# Altium project FPW1-0-0.PrjPCB (part 2 of 2)
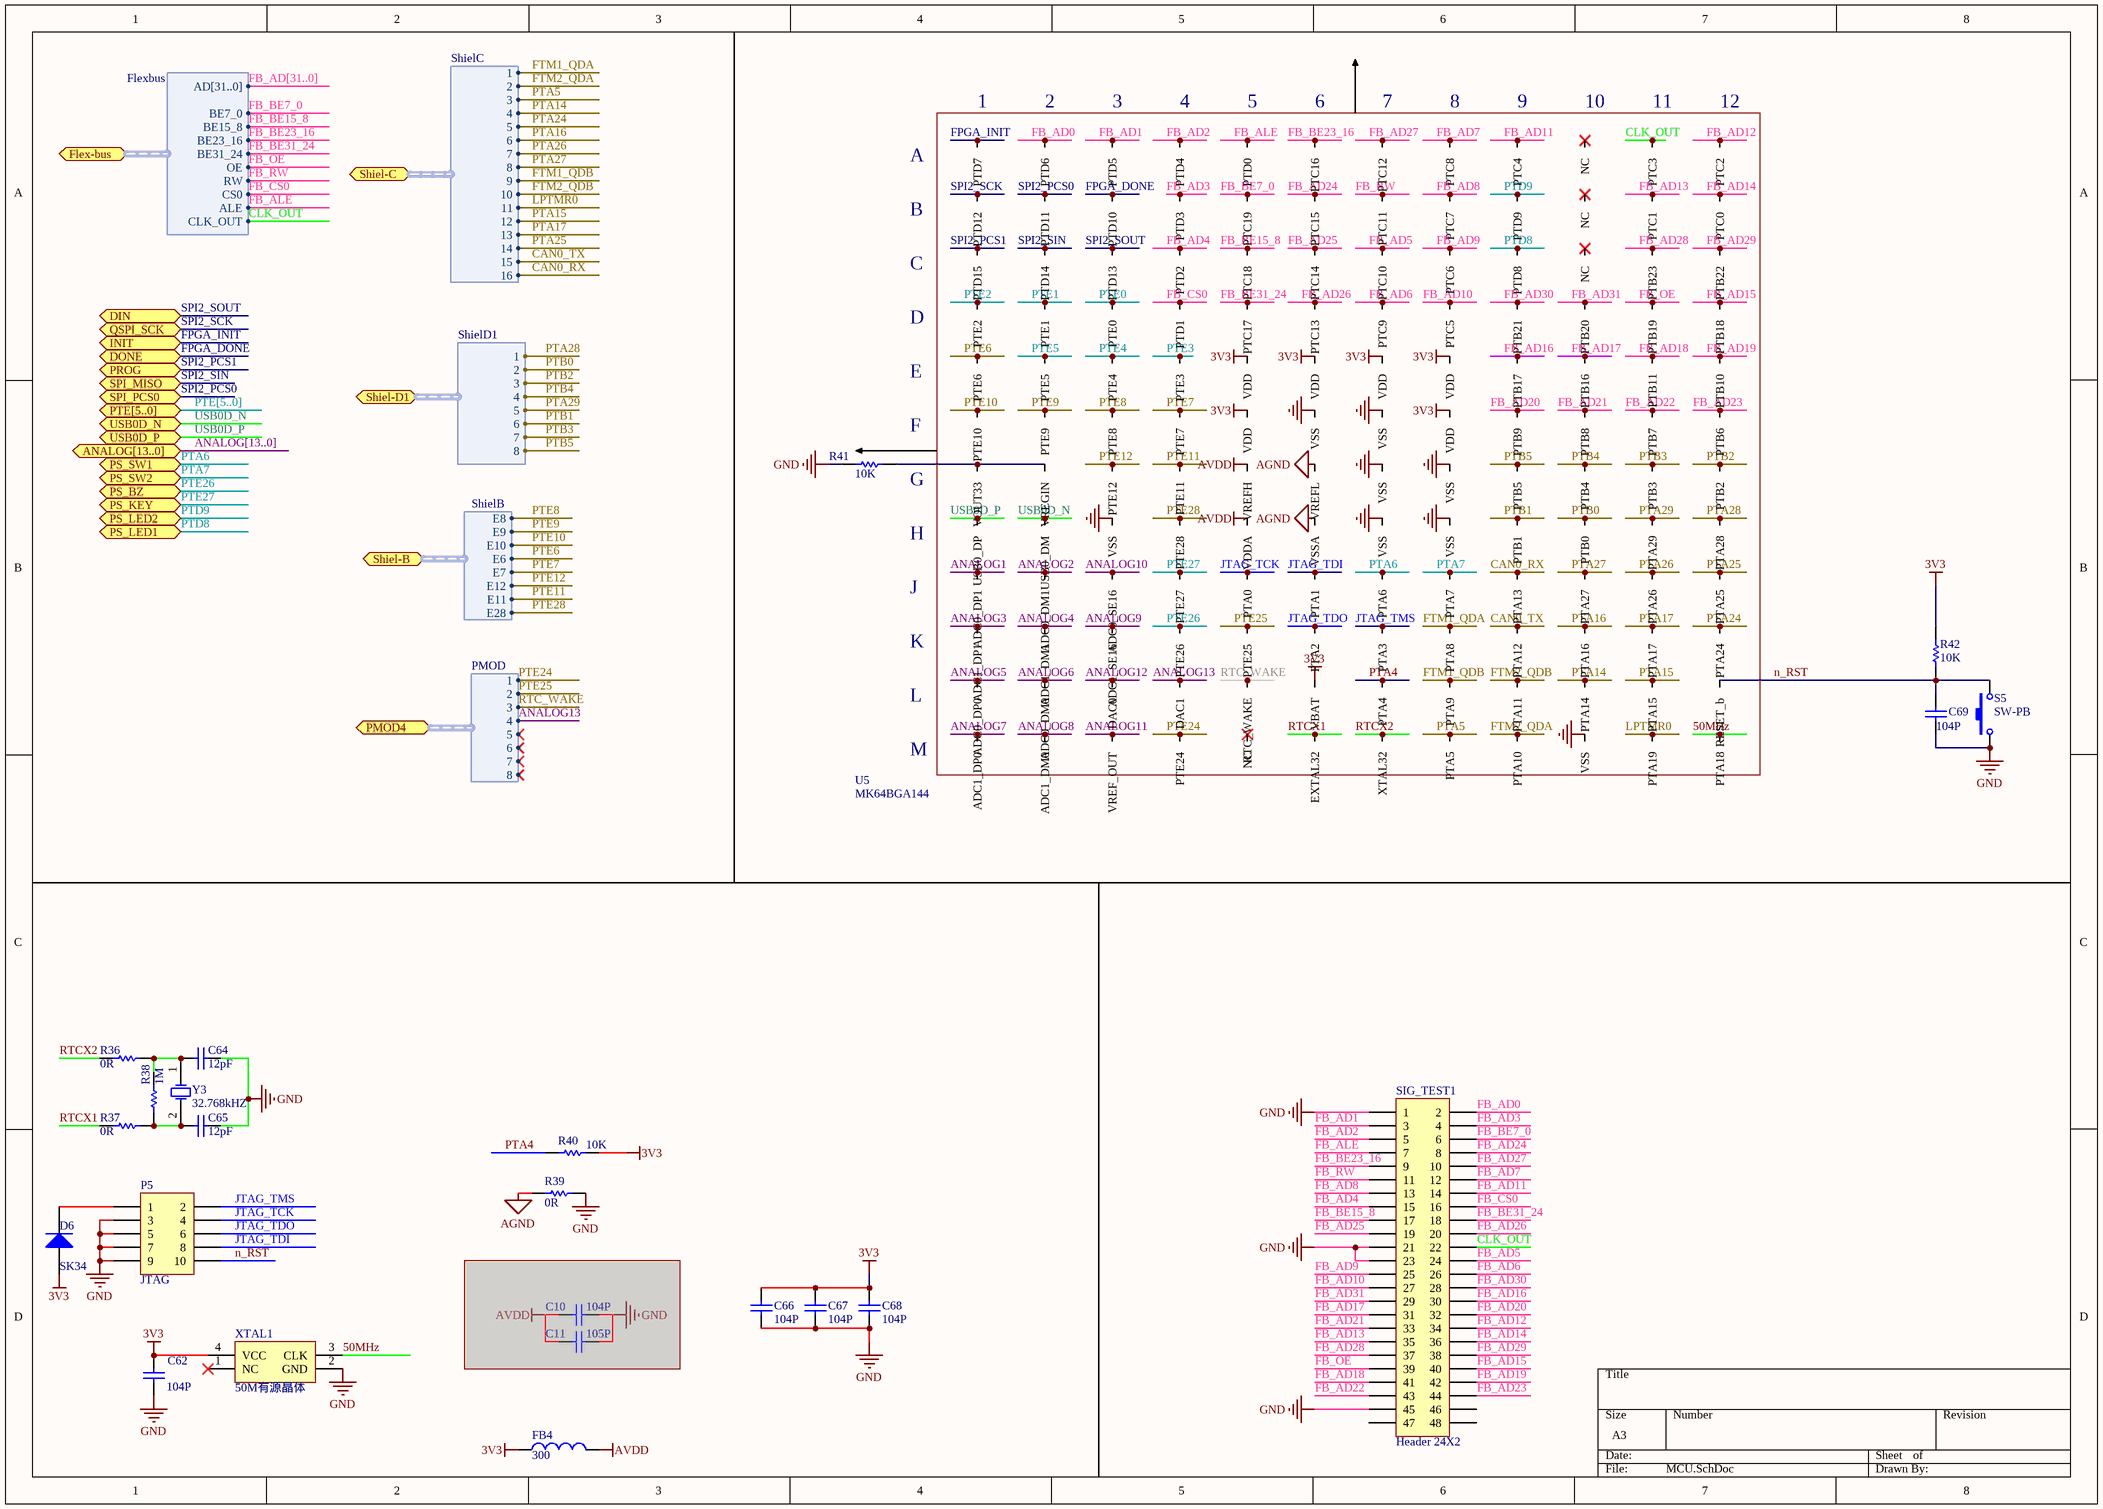
[diagram p8: MCU.SchDoc]

## Nets that join several sheets
1V0: POWER (F2.1), FPGA_POWER (21 pins)
1V8: POWER (F4.1), FPGA_POWER (12 pins)
3V3: FPGA_IO (9 pins), POWER (F3.1), GENERAL-IO (21 pins), MEMORY (8 pins), FPGA_CONFIG (10 pins), FPGA_POWER (55 pins), MCU (16 pins)
5V0: POWER (15 pins), GENERAL-IO (F1.1)
GND: FPGA_IO (6 pins), POWER (11 pins), GENERAL-IO (32 pins), MEMORY (6 pins), FPGA_CONFIG (16 pins), FPGA_POWER (83 pins), MCU (27 pins)
XADCGND: FPGA_CONFIG (U1.H7 U1.H8 U1.J7 U1.J8), FPGA_POWER (C14.2 FB2.2 U1.G7)
ANALOG13: GENERAL-IO (PMOD4.3), MCU (U5.L4)
BANK14_IO1: FPGA_IO (U1.K12), GENERAL-IO (S2.1)
BANK14_IO2: FPGA_IO (U1.L14), GENERAL-IO (LED1.3)
BANK14_IO3: FPGA_IO (U1.M14), GENERAL-IO (HAT1.5)
BANK14_IO4: FPGA_IO (U1.K13), GENERAL-IO (LED1.1)
BANK14_IO5: FPGA_IO (U1.L13), GENERAL-IO (LED1.4)
BANK14_IO6: FPGA_IO (U1.M12), GENERAL-IO (R24.2)
BANK14_IO7: FPGA_IO (U1.M16), GENERAL-IO (HAT1.3)
BANK14_IO8: FPGA_IO (U1.N16), GENERAL-IO (HAT1.7)
BANK14_IO9: FPGA_IO (U1.P15), GENERAL-IO (HAT1.12)
BANK14_IO10: FPGA_IO (U1.P16), GENERAL-IO (HAT1.11)
BANK14_IO11: FPGA_IO (U1.R15), GENERAL-IO (HAT1.15)
BANK14_IO12: FPGA_IO (U1.R16), GENERAL-IO (HAT1.13)
BANK14_IO13: FPGA_IO (U1.T14), GENERAL-IO (HAT1.18)
BANK14_IO14: FPGA_IO (U1.T15), GENERAL-IO (HAT1.16)
BANK14_IO15: FPGA_IO (U1.N13), GENERAL-IO (HAT1.10)
BANK14_IO16: FPGA_IO (U1.P13), GENERAL-IO (HAT1.21)
BANK14_IO17: FPGA_IO (U1.N14), GENERAL-IO (HAT1.8)
BANK14_IO18: FPGA_IO (U1.P14), GENERAL-IO (HAT1.19)
BANK14_IO19: FPGA_IO (U1.N12), GENERAL-IO (HAT1.27)
BANK14_IO20: FPGA_IO (U1.P10), GENERAL-IO (HAT1.31)
BANK14_IO21: FPGA_IO (U1.P11), GENERAL-IO (HAT1.28)
BANK14_IO22: FPGA_IO (U1.R12), GENERAL-IO (HAT1.24)
BANK14_IO23: FPGA_IO (U1.T12), GENERAL-IO (HAT1.26)
BANK14_IO24: FPGA_IO (U1.R13), GENERAL-IO (HAT1.23)
BANK14_IO25: FPGA_IO (U1.T13), GENERAL-IO (HAT1.22)
BANK14_IO26: FPGA_IO (U1.R10), GENERAL-IO (HAT1.33)
BANK14_IO27: FPGA_IO (U1.R11), GENERAL-IO (HAT1.29)
BANK14_IO28: FPGA_IO (U1.N9), GENERAL-IO (HAT1.37)
BANK14_IO29: FPGA_IO (U1.P9), GENERAL-IO (HAT1.36)
BANK14_IO30: FPGA_IO (U1.M6), GENERAL-IO (R50.2)
BANK14_IO32: FPGA_IO (U1.P8), GENERAL-IO (R51.8)
BANK14_IO33: FPGA_IO (U1.R8), GENERAL-IO (HAT1.40)
BANK14_IO34: FPGA_IO (U1.T7), GENERAL-IO (R51.6)
BANK14_IO35: FPGA_IO (U1.T8), GENERAL-IO (HAT1.38)
BANK14_IO36: FPGA_IO (U1.T9), GENERAL-IO (HAT1.35)
BANK14_IO37: FPGA_IO (U1.T10), GENERAL-IO (HAT1.32)
BANK14_IO38: FPGA_IO (U1.R5), GENERAL-IO (R50.4)
BANK14_IO39: FPGA_IO (U1.T5), GENERAL-IO (R50.6)
BANK14_IO40: FPGA_IO (U1.R6), GENERAL-IO (R51.2)
BANK14_IO41: FPGA_IO (U1.R7), GENERAL-IO (R51.4)
BANK14_IO42: FPGA_IO (U1.P6), GENERAL-IO (R50.8)
BANK34_IO1: FPGA_IO (U1.L5), GENERAL-IO (Shiel1.64)
BANK34_IO2: FPGA_IO (U1.L4), GENERAL-IO (Shiel1.63)
BANK34_IO3: FPGA_IO (U1.M4), GENERAL-IO (R47.2)
BANK34_IO4: FPGA_IO (U1.M2), GENERAL-IO (R48.4)
BANK34_IO5: FPGA_IO (U1.M1), GENERAL-IO (R48.2)
BANK34_IO6: FPGA_IO (U1.N3), GENERAL-IO (R47.4)
BANK34_IO7: FPGA_IO (U1.N2), GENERAL-IO (R48.8)
BANK34_IO8: FPGA_IO (U1.N1), GENERAL-IO (R48.6)
BANK34_IO9: FPGA_IO (U1.P1), GENERAL-IO (R49.2)
BANK34_IO10: FPGA_IO (U1.P4), GENERAL-IO (R49.6)
BANK34_IO11: FPGA_IO (U1.P3), GENERAL-IO (R49.4)
BANK34_IO12: FPGA_IO (U1.M5), GENERAL-IO (R47.6)
BANK34_IO13: FPGA_IO (U1.N4), GENERAL-IO (S3.2)
BANK34_IO14: FPGA_IO (U1.R2), GENERAL-IO (R46.2)
BANK34_IO15: FPGA_IO (U1.R1), GENERAL-IO (R49.8)
BANK34_IO16: FPGA_IO (U1.R3), GENERAL-IO (R46.6)
BANK34_IO17: FPGA_IO (U1.T2), GENERAL-IO (R46.4)
BANK34_IO18: FPGA_IO (U1.T4), GENERAL-IO (R47.8)
BANK34_IO19: FPGA_IO (U1.T3), GENERAL-IO (R46.8)
BANK34_IO20: FPGA_IO (U1.P5), GENERAL-IO (S3.1)
BANK35_IO1: FPGA_IO (U1.E6), GENERAL-IO (Shiel1.60)
BANK35_IO2: FPGA_IO (U1.B7), GENERAL-IO (Shiel1.53)
BANK35_IO3: FPGA_IO (U1.A7), GENERAL-IO (Shiel1.54)
BANK35_IO4: FPGA_IO (U1.B6), GENERAL-IO (Shiel1.57)
BANK35_IO5: FPGA_IO (U1.C7), GENERAL-IO (Shiel1.55)
BANK35_IO6: FPGA_IO (U1.C6), GENERAL-IO (Shiel1.58)
BANK35_IO7: FPGA_IO (U1.D6), GENERAL-IO (Shiel1.56)
BANK35_IO8: FPGA_IO (U1.D5), GENERAL-IO (Shiel1.59)
BANK35_IO9: FPGA_IO (U1.F5), GENERAL-IO (Shiel1.61)
BANK35_IO10: FPGA_IO (U1.K5), GENERAL-IO (Shiel1.62)
CAN0_RX: GENERAL-IO (Shiel1.44), MCU (U5.J9)
CAN0_TX: GENERAL-IO (Shiel1.42), MCU (U5.K9)
CLK_OUT: FPGA_IO (U1.D13), MCU (SIG_TEST1.22 U5.A11)
DIN: FPGA_IO (R16.2 U1.J14), FPGA_CONFIG (MCU_CFG1.3), MCU (U5.C3)
DONE: FPGA_CONFIG (R8.1 R9.2 U1.H10), MCU (U5.B3)
FB_AD0: FPGA_IO (U1.J15), MCU (SIG_TEST1.2 U5.A2)
FB_AD1: FPGA_IO (U1.J16), MCU (SIG_TEST1.3 U5.A3)
FB_AD2: FPGA_IO (U1.H14), MCU (SIG_TEST1.5 U5.A4)
FB_AD3: FPGA_IO (U1.H13), MCU (SIG_TEST1.4 U5.B4)
FB_AD4: FPGA_IO (U1.E12), MCU (SIG_TEST1.15 U5.C4)
FB_AD5: FPGA_IO (U1.B15), MCU (SIG_TEST1.24 U5.C7)
FB_AD6: FPGA_IO (U1.C14), MCU (SIG_TEST1.26 U5.D7)
FB_AD7: FPGA_IO (U1.E15), MCU (SIG_TEST1.12 U5.A8)
FB_AD8: FPGA_IO (U1.E16), MCU (SIG_TEST1.13 U5.B8)
FB_AD9: FPGA_IO (U1.A15), MCU (SIG_TEST1.25 U5.C8)
FB_AD10: FPGA_IO (U1.B14), MCU (SIG_TEST1.27 U5.D8)
FB_AD11: FPGA_IO (U1.E13), MCU (SIG_TEST1.14 U5.A9)
FB_AD12: FPGA_IO (U1.C11), MCU (SIG_TEST1.34 U5.A12)
FB_AD13: FPGA_IO (U1.B11), MCU (SIG_TEST1.35 U5.B11)
FB_AD14: FPGA_IO (U1.D10), MCU (SIG_TEST1.36 U5.B12)
FB_AD15: FPGA_IO (U1.B9), MCU (SIG_TEST1.40 U5.D12)
FB_AD16: FPGA_IO (U1.A13), MCU (SIG_TEST1.30 U5.E9)
FB_AD17: FPGA_IO (U1.C12), MCU (SIG_TEST1.31 U5.E10)
FB_AD18: FPGA_IO (U1.A9), MCU (SIG_TEST1.41 U5.E11)
FB_AD19: FPGA_IO (U1.D9), MCU (SIG_TEST1.42 U5.E12)
FB_AD20: FPGA_IO (U1.B12), MCU (SIG_TEST1.32 U5.F9)
FB_AD21: FPGA_IO (U1.A12), MCU (SIG_TEST1.33 U5.F10)
FB_AD22: FPGA_IO (U1.C8), MCU (SIG_TEST1.43 U5.F11)
FB_AD23: FPGA_IO (U1.A8), MCU (SIG_TEST1.44 U5.F12)
FB_AD24: FPGA_IO (U1.G16), MCU (SIG_TEST1.8 U5.B6)
FB_AD25: FPGA_IO (U1.C16), MCU (SIG_TEST1.19 U5.C6)
FB_AD26: FPGA_IO (U1.B16), MCU (SIG_TEST1.20 U5.D6)
FB_AD27: FPGA_IO (U1.F15), MCU (SIG_TEST1.10 U5.A7)
FB_AD28: FPGA_IO (U1.B10), MCU (SIG_TEST1.37 U5.C11)
FB_AD29: FPGA_IO (U1.A10), MCU (SIG_TEST1.38 U5.C12)
FB_AD30: FPGA_IO (U1.A14), MCU (SIG_TEST1.28 U5.D9)
FB_AD31: FPGA_IO (U1.C13), MCU (SIG_TEST1.29 U5.D10)
FB_ALE: FPGA_IO (U1.G15), MCU (SIG_TEST1.7 U5.A5)
FB_BE7_0: FPGA_IO (U1.H16), MCU (SIG_TEST1.6 U5.B5)
FB_BE15_8: FPGA_IO (U1.D15), MCU (SIG_TEST1.17 U5.C5)
FB_BE23_16: FPGA_IO (U1.G14), MCU (SIG_TEST1.9 U5.A6)
FB_BE31_24: FPGA_IO (U1.D14), MCU (SIG_TEST1.18 U5.D5)
FB_CS0: FPGA_IO (U1.D16), MCU (SIG_TEST1.16 U5.D4)
FB_OE: FPGA_IO (U1.C9), MCU (SIG_TEST1.39 U5.D11)
FB_RW: FPGA_IO (U1.F14), MCU (SIG_TEST1.11 U5.B7)
FPGA_INIT: FPGA_CONFIG (R11.1 R12.2 U1.K10), MCU (U5.A1)
FTM1_QDA: GENERAL-IO (Shiel1.29), MCU (U5.K8)
FTM1_QDB: GENERAL-IO (Shiel1.30), MCU (U5.L8)
FTM2_QDA: GENERAL-IO (Shiel1.31), MCU (U5.M9)
FTM2_QDB: GENERAL-IO (Shiel1.32), MCU (U5.L9)
LPTMR0: GENERAL-IO (Shiel1.34), MCU (U5.M11)
PROG: FPGA_CONFIG (JTAG1.14 R10.1 S1.2 U1.L9), MCU (U5.C1)
PTA5: GENERAL-IO (Shiel1.33), MCU (U5.M8)
PTA6: GENERAL-IO (S6.1), MCU (U5.J7)
PTA7: GENERAL-IO (S6.2), MCU (U5.J8)
PTA14: GENERAL-IO (Shiel1.35), MCU (U5.L10)
PTA15: GENERAL-IO (Shiel1.36), MCU (U5.L11)
PTA16: GENERAL-IO (Shiel1.39), MCU (U5.K10)
PTA17: GENERAL-IO (Shiel1.38), MCU (U5.K11)
PTA24: GENERAL-IO (Shiel1.37), MCU (U5.K12)
PTA25: GENERAL-IO (Shiel1.40), MCU (U5.J12)
PTA26: GENERAL-IO (Shiel1.41), MCU (U5.J11)
PTA27: GENERAL-IO (Shiel1.43), MCU (U5.J10)
PTA28: GENERAL-IO (Shiel1.45), MCU (U5.H12)
PTA29: GENERAL-IO (Shiel1.46), MCU (U5.H11)
PTB0: GENERAL-IO (Shiel1.47), MCU (U5.H10)
PTB1: GENERAL-IO (Shiel1.48), MCU (U5.H9)
PTB2: GENERAL-IO (Shiel1.49), MCU (U5.G12)
PTB3: GENERAL-IO (Shiel1.50), MCU (U5.G11)
PTB4: GENERAL-IO (Shiel1.51), MCU (U5.G10)
PTB5: GENERAL-IO (Shiel1.52), MCU (U5.G9)
PTD8: GENERAL-IO (L6.1), MCU (U5.C9)
PTD9: GENERAL-IO (L5.1), MCU (U5.B9)
PTE6: GENERAL-IO (Shiel1.19), MCU (U5.E1)
PTE7: GENERAL-IO (Shiel1.21), MCU (U5.F4)
PTE8: GENERAL-IO (Shiel1.13), MCU (U5.F3)
PTE9: GENERAL-IO (Shiel1.15), MCU (U5.F2)
PTE10: GENERAL-IO (Shiel1.17), MCU (U5.F1)
PTE11: GENERAL-IO (Shiel1.25), MCU (U5.G4)
PTE12: GENERAL-IO (Shiel1.23), MCU (U5.G3)
PTE24: GENERAL-IO (PMOD4.4), MCU (U5.M4)
PTE25: GENERAL-IO (PMOD4.5), MCU (U5.K5)
PTE26: GENERAL-IO (R52.2), MCU (U5.K4)
PTE27: GENERAL-IO (S4.1), MCU (U5.J4)
PTE28: GENERAL-IO (Shiel1.27), MCU (U5.H4)
QSPI_SCK: FPGA_IO (R20.1 U2.6), FPGA_CONFIG (MCU_CFG1.4 U1.E8), MCU (U5.B1)
RTC_WAKE: GENERAL-IO (PMOD4.6), MCU (U5.L5)
SPI2_PCS0: FPGA_CONFIG (MCU_CFG1.2), MCU (U5.B2)
SPI2_SIN: FPGA_CONFIG (MCU_CFG1.1), MCU (U5.C2)
SRAM_CS: FPGA_IO (U1.J3), MEMORY (R43.1 U6.B5)
SRAM_OE: FPGA_IO (U1.G4), MEMORY (R45.1 U6.A2)
SRAM_WR: FPGA_IO (U1.C4), MEMORY (R44.1 U6.G5)
USB0D_N: GENERAL-IO (R25.2), MCU (U5.H2)
USB0D_P: GENERAL-IO (R26.2), MCU (U5.H1)